# EAGLE schematic Power Board to eagle (EAGLE 7.5.0)

## Sheet 1 of 4
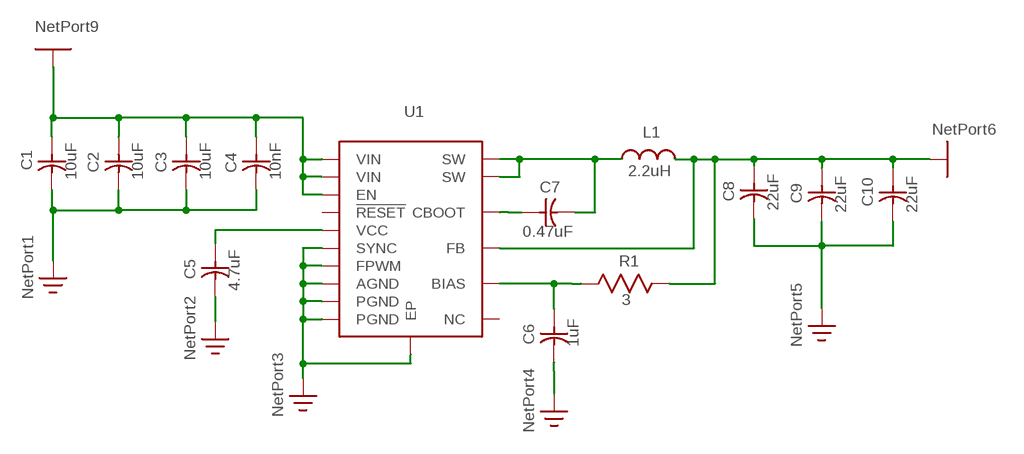
[diagram p0: schematic, sheet 1]

### Parts
C1  10uF  2X7_HEADER_SHROUDED  [CAP_1210]
C2  10uF  CAP_1210  [CAP_1210]
C3  10uF  CAP_1210  [CAP_1210]
C4  10nF  CAP_0603  [CAP_0603]
C5  4.7uF  CAP_0805  [CAP_0805]
C6  1uF  CAP_0603  [CAP_0603]
C7  0.47uF  CAP_0603  [CAP_0603]
C8  22uF  CAP_1206  [CAP_1206]
C9  22uF  CAP_1206  [CAP_1206]
C10  22uF  CAP_1206  [CAP_1206]
L1  2.2uH  FIXED_IND_SM_-_NS_PKG.  [Ind._6x6x2.8mm]
R1  3  RES_0805  [RES_0805]
U1  LM53603-Q1  [LM53603-Q1]

### Nets
5V: C8.1 C9.1 C10.1 L1.2 R1.2 U1.9(FB) ; supply symbol labelled +5V ; also sheet 2
12V: C1.1 C2.1 C3.1 C4.1 U1.11(EN) U1.12(VIN) U1.13(VIN) ; supply symbol labelled +12V ; also sheet 3,4
GND: C1.2 C2.2 C3.2 C4.2 C5.2 C6.2 C8.2 C9.2 C10.2 U1.6(SYNC) U1.7(FPWM) U1.10(AGND) U1.15(PGND) U1.16(PGND) U1.17(EP) ; also sheet 2,3,4
Net_3: C5.1 U1.4(VCC)
Net_4: C6.1 R1.1 U1.5(BIAS)
Net_5: C7.1 U1.3(CBOOT)
Net_6: C7.2 L1.1 U1.1(SW) U1.2(SW)
Unconnected: U1.8(!RESET) U1.14(NC)

## Sheet 2 of 4
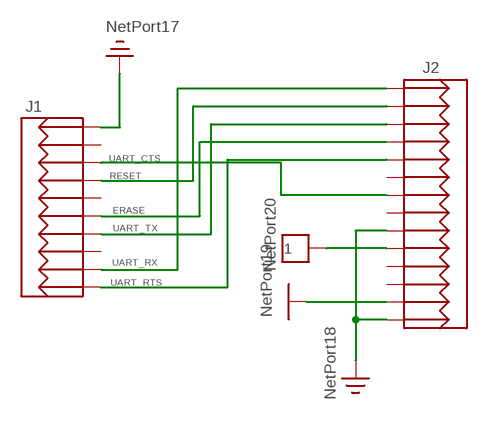
[diagram p1: schematic, sheet 2]

### Parts
J1  PBOARD  [2x5_Header_Shrouded]
J2  HUB  [2x7_Header_Shrouded]

### Nets
5V: J2.2 ; supply symbol labelled +5V ; also sheet 1
ERASE: J1.6 J2.11
GND: J1.1 J2.1 J2.6 ; also sheet 1,3,4
Net_23: J2.5 ; supply symbol labelled PORT1 ; also sheet 4
RESET: J1.4 J2.13
UART_CTS: J1.3 J2.8
UART_RTS: J1.10 J2.10
UART_RX: J1.9 J2.14
UART_TX: J1.7 J2.12
Unconnected: J1.2 J1.5 J1.8 J2.3 J2.4 J2.7 J2.9

## Sheet 3 of 4
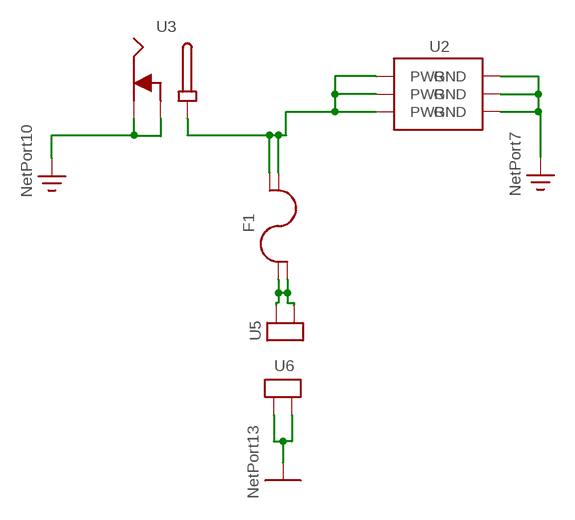
[diagram p2: schematic, sheet 3]

### Parts
F1  BLADE_FUSE_CLIP  [Blade_Fuse_Clip]
U2  MOLEX_6-PIN_PWR  [Molex_6-Pin_Pwr]
U3  DC_POWER_JACK  [DC_Power_Jack]
U5  0.250''_MALE_QUICK_CONN  [0.250"_Male_Quick_Conn]
U6  0.250''_MALE_QUICK_CONN  [0.250"_Male_Quick_Conn]

### Nets
12V: U6.1 U6.2 ; supply symbol labelled +12V ; also sheet 1,4
GND: U2.4(GND) U2.5(GND) U2.6(GND) U3.2 U3.3 ; also sheet 1,2,4
Net_0: F1.1 F1.2 U5.1 U5.2
Net_8: F1.3 F1.4 U2.1(PWR) U2.2(PWR) U2.3(PWR) U3.1

## Sheet 4 of 4
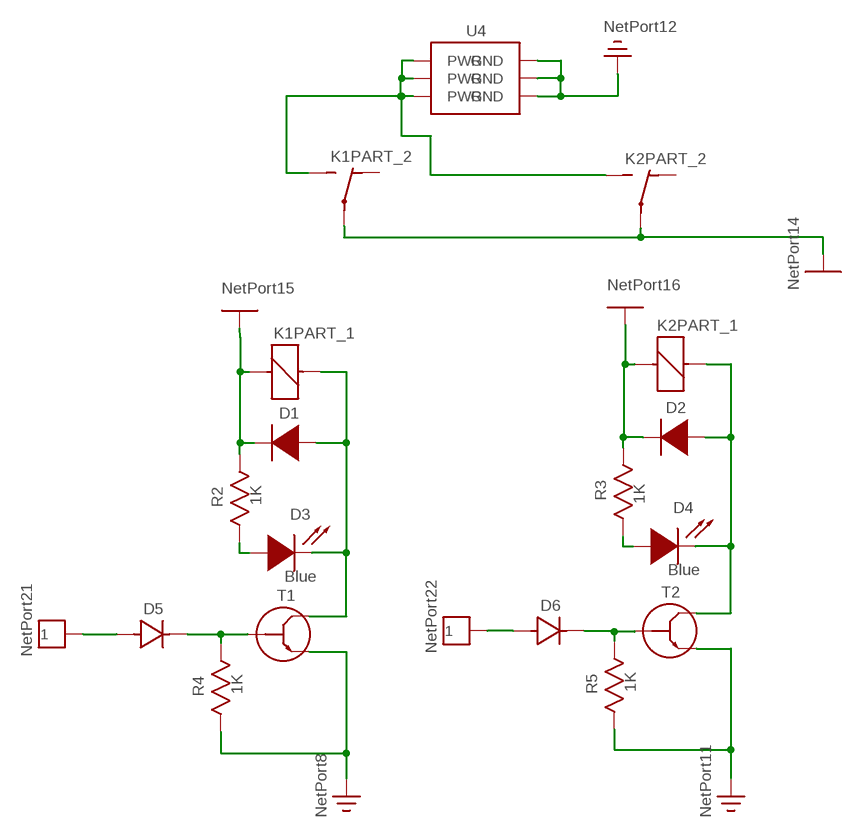
[diagram p3: schematic, sheet 4]

### Parts
D1  S1A/B_GEN_PURP_DIODE  [S1A/B_Gen_Purp_Diode]
D2  S1A/B_GEN_PURP_DIODE  [S1A/B_Gen_Purp_Diode]
D3  Blue  BLUE_LED_0805  [Blue_LED_0805]
D4  Blue  BLUE_LED_0805  [Blue_LED_0805]
D5  DIODE_0805  [DIO_0805]
D6  DIODE_0805  [DIO_0805]
K1  G5LE  [G5LE]
K2  G5LE_4  [G5LE]
R2  1K  RES_0805  [RES_0805]
R3  1K  RES_0805  [RES_0805]
R4  1K  RES_0805  [RES_0805]
R5  1K  RES_0805  [RES_0805]
T1  TRANS_PREBIAS_NPN_SOT23-3  [Trans_PreBias_NPN_Sot23-3]
T2  TRANS_PREBIAS_NPN_SOT23-3  [Trans_PreBias_NPN_Sot23-3]
U4  MOLEX_6-PIN_PWR  [Molex_6-Pin_Pwr]

### Nets
12V: D1.2(Cathode-) D2.2(Cathode-) K1.1 K1.P(PART_2:P) K2.1 K2.P(PART_2:P) R2.2 R3.2 ; supply symbol labelled +12V ; also sheet 1,3
GND: R4.1 R5.1 T1.2(Emitter) T2.2(Emitter) U4.4(GND) U4.5(GND) U4.6(GND) ; also sheet 1,2,3
Net_11: D3.1 R2.1
Net_12: D4.1 R3.1
Net_13: D1.1(Anode+) D3.2 K1.2 T1.3(Collector)
Net_14: D2.1(Anode+) D4.2 K2.2 T2.3(Collector)
Net_21: D6.1(K) R5.2 T2.1(Base)
Net_22: D5.1(K) R4.2 T1.1(Base)
Net_23: D5.2(A) D6.2(A) ; supply symbol labelled PORT1 ; also sheet 2
Switched_12V: K1.S(PART_2:S) K2.S(PART_2:S) U4.1(PWR) U4.2(PWR) U4.3(PWR)
Unconnected: K1.O(PART_2:O) K2.O(PART_2:O)

## Library data of the parts
C1 = common:2X7_HEADER_SHROUDED
C2 C3 = common:CAP_1210
C4 = common:CAP_0603
C5 = common:CAP_0805
C6 C7 = common:CAP_0603; VALUE: 10nF
C8-C10 = common:CAP_1206
D1 D2 = common:S1A/B_GEN_PURP_DIODE; DATASHEET: http://www.diodes.com/_files/datasheets/ds16003.pdf; MANUFACTURER: Diodes Incorporated
D3 D4 = common:BLUE_LED_0805; DATASHEET: http://optoelectronics.liteon.com/upload/download/DS22-2000-233/S_110_LTST-C171TBKT(0630).pdf; MANUFACTURER: Lite-On Inc
D5 D6 = common:DIODE_0805
F1 = common:BLADE_FUSE_CLIP; DATASHEET: http://www.memoryprotectiondevices.com/datasheets/BK-6011-datasheet.pdf; MANUFACTURER: MPD
J1 = common:PBOARD; DATASHEET: http://www.on-shore.com/wp-content/uploads/2015/09/302-sxxx.pdf; MANUFACTURER: OST On Shore Technology
J2 = common:HUB; DATASHEET: http://sullinscorp.com/catalogs/145_PAGE118_.100_SBH11_SERIES_MALE_BOX_HDR_ST_RA_SMT.pdf
K1 = common:G5LE
K2 = common:G5LE_4
L1 = common:FIXED_IND_SM_-_NS_PKG.; DATASHEET: http://www.yuden.co.jp/productdata/catalog/en/wound04_e.pdf; MANUFACTURER: Taiyo Yuden
R1 = common:RES_0805
R2-R5 = common:RES_0805; VALUE: 3
T1 T2 = common:TRANS_PREBIAS_NPN_SOT23-3; DATASHEET: http://www.onsemi.com/pub_link/Collateral/DTC114E-D.PDF; MANUFACTURER: ON Semiconductor
U1 = common:LM53603-Q1; DATASHEET: http://www.ti.com/lit/ds/symlink/lm53602-q1.pdf; MANUFACTURER: Texas Instruments
U2 U4 = common:MOLEX_6-PIN_PWR; DATASHEET: http://www.molex.com/pdm_docs/sd/039301062_sd.pdf; MANUFACTURER: Molex
U3 = common:DC_POWER_JACK; DATASHEET: http://www.cui.com/product/resource/pj-002a.pdf; MANUFACTURER: CUI Inc.
U5 U6 = common:0.250''_MALE_QUICK_CONN; MANUFACTURER: TE Connectivity